# EAGLE design next_if_toy (EAGLE 9.6.2)
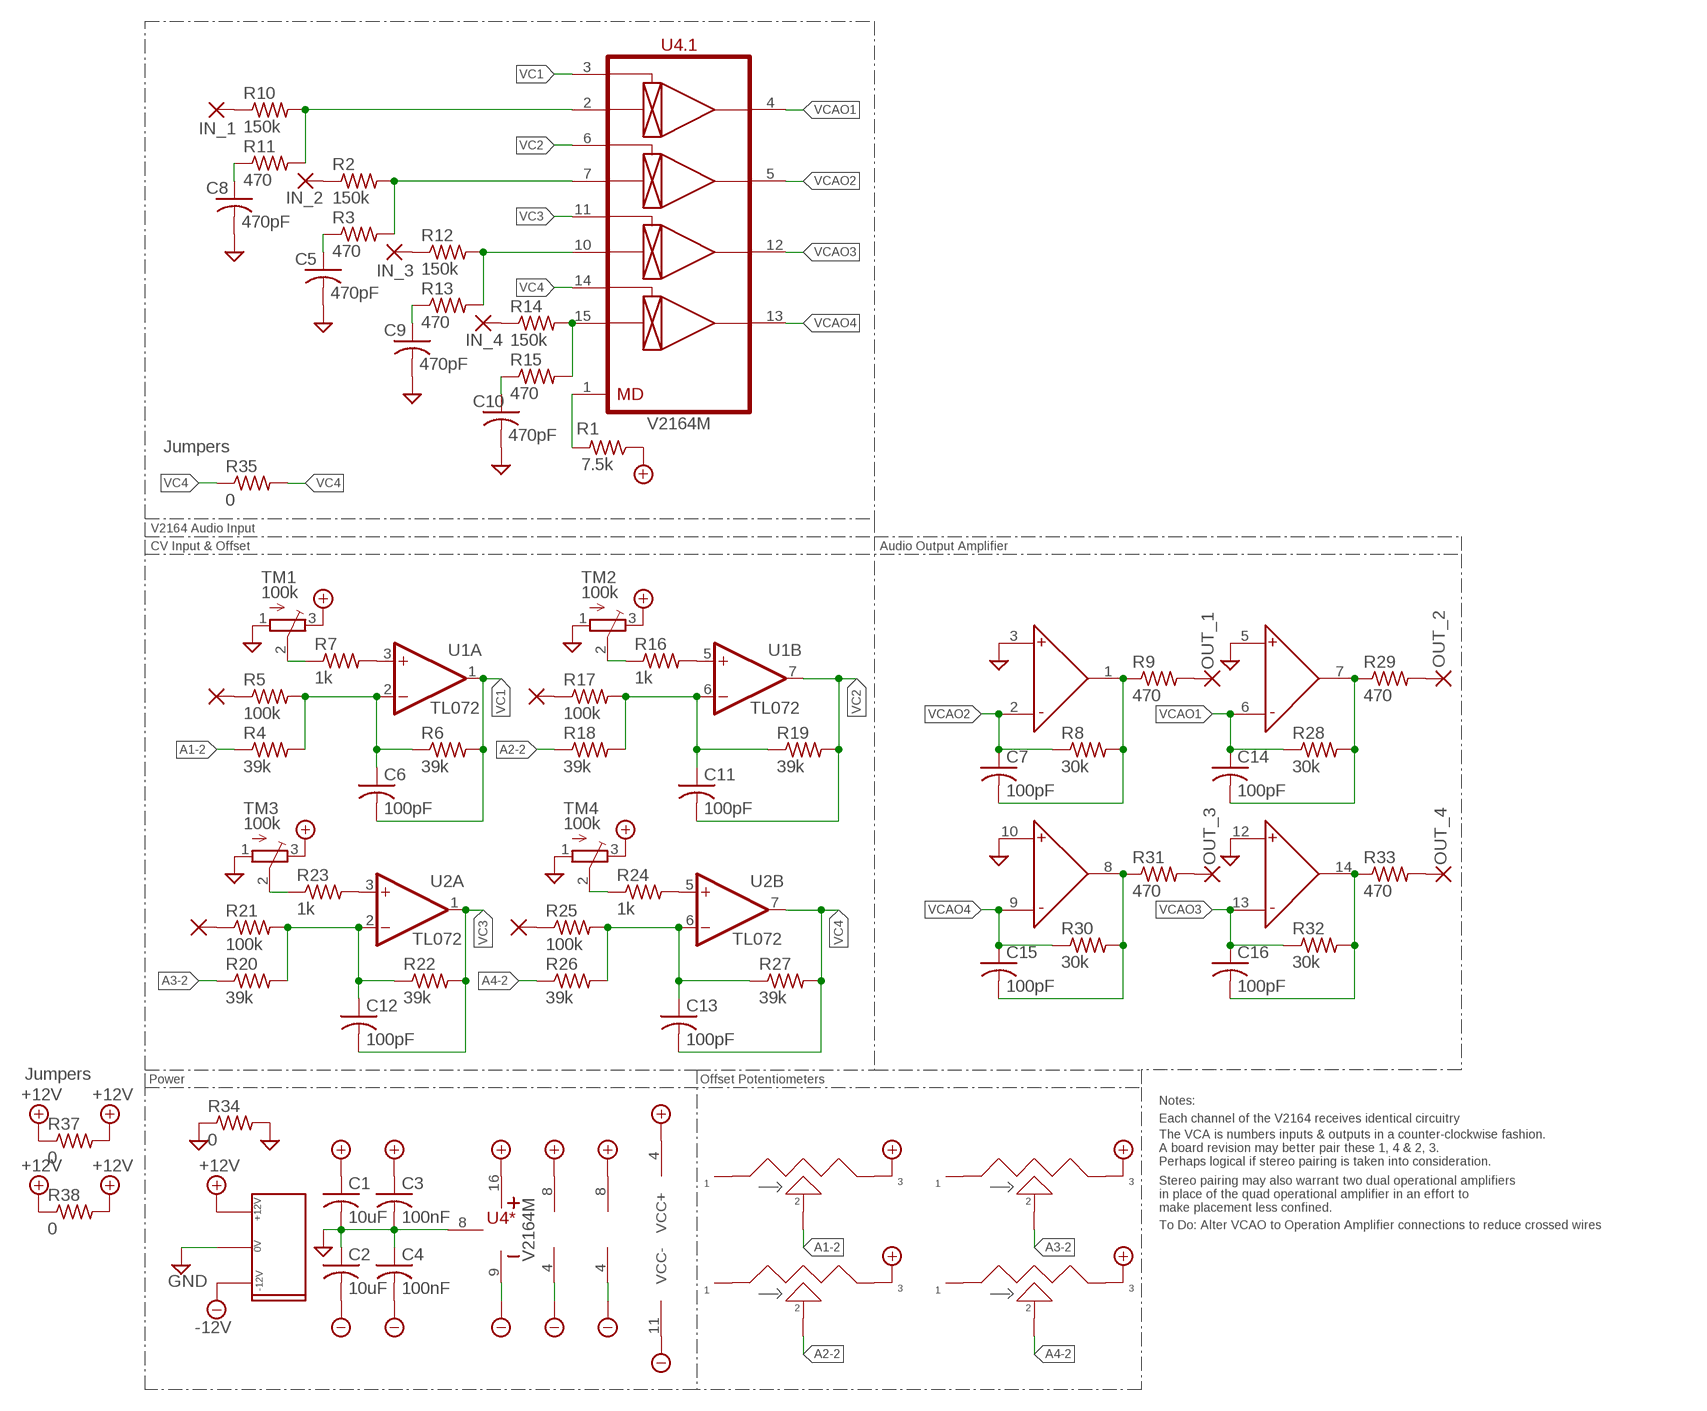
[diagram p0: schematic, sheet 1]

## Parts
AMT1  B50k  POT_9MM_SMD  [POT_9MM_SMD]
AMT2  B50k  POT_9MM_SMD  [POT_9MM_SMD]
AMT3  B50k  POT_9MM_SMD  [POT_9MM_SMD]
AMT4  B50k  POT_9MM_SMD  [POT_9MM_SMD]
C1  10uF  C-USC1206  [C1206]
C2  10uF  C-USC1206  [C1206]
C3  100nF  C-USC0603  [C0603]
C4  100nF  C-USC0603  [C0603]
C5  470pF  C-USC0603  [C0603]
C6  100pF  C-USC0603  [C0603]
C7  100pF  C-USC0603  [C0603]
C8  470pF  C-USC0603  [C0603]
C9  470pF  C-USC0603  [C0603]
C10  470pF  C-USC0603  [C0603]
C11  100pF  C-USC0603  [C0603]
C12  100pF  C-USC0603  [C0603]
C13  100pF  C-USC0603  [C0603]
C14  100pF  C-USC0603  [C0603]
C15  100pF  C-USC0603  [C0603]
C16  100pF  C-USC0603  [C0603]
CV1  SMD2  [SMD1,27-2,54]
CV2  SMD2  [SMD1,27-2,54]
CV3  SMD2  [SMD1,27-2,54]
CV4  SMD2  [SMD1,27-2,54]
I1  SMD2  [SMD1,27-2,54]
I2  SMD2  [SMD1,27-2,54]
I3  SMD2  [SMD1,27-2,54]
I4  SMD2  [SMD1,27-2,54]
O1  SMD2  [SMD1,27-2,54]
O2  SMD2  [SMD1,27-2,54]
O3  SMD2  [SMD1,27-2,54]
O4  SMD2  [SMD1,27-2,54]
R1  7.5k  R-US_R0603  [R0603]
R2  150k  R-US_R0603  [R0603]
R3  470  R-US_R0603  [R0603]
R4  39k  R-US_R0603  [R0603]
R5  100k  R-US_R0603  [R0603]
R6  39k  R-US_R0603  [R0603]
R7  1k  R-US_R0603  [R0603]
R8  30k  R-US_R0603  [R0603]
R9  470  R-US_R0603  [R0603]
R10  150k  R-US_R0603  [R0603]
R11  470  R-US_R0603  [R0603]
R12  150k  R-US_R0603  [R0603]
R13  470  R-US_R0603  [R0603]
R14  150k  R-US_R0603  [R0603]
R15  470  R-US_R0603  [R0603]
R16  1k  R-US_R0603  [R0603]
R17  100k  R-US_R0603  [R0603]
R18  39k  R-US_R0603  [R0603]
R19  39k  R-US_R0603  [R0603]
R20  39k  R-US_R0603  [R0603]
R21  100k  R-US_R0603  [R0603]
R22  39k  R-US_R0603  [R0603]
R23  1k  R-US_R0603  [R0603]
R24  1k  R-US_R0603  [R0603]
R25  100k  R-US_R0603  [R0603]
R26  39k  R-US_R0603  [R0603]
R27  39k  R-US_R0603  [R0603]
R28  30k  R-US_R0603  [R0603]
R29  470  R-US_R0603  [R0603]
R30  30k  R-US_R0603  [R0603]
R31  470  R-US_R0603  [R0603]
R32  30k  R-US_R0603  [R0603]
R33  470  R-US_R0603  [R0603]
R34  0  R-US_R0402  [R0402]
R35  0  R-US_R0402  [R0402]
R37  0  R-US_R0402  [R0402]
R38  0  R-US_R0402  [R0402]
TM1  100k  TRIMPOTTC33X  [TC33X]
TM2  100k  TRIMPOTTC33X  [TC33X]
TM3  100k  TRIMPOTTC33X  [TC33X]
TM4  100k  TRIMPOTTC33X  [TC33X]
U1  TL072  TL072TSSOP  [TSSOP-8]
U2  TL072  TL072TSSOP  [TSSOP-8]
U3  TL074TSSOP-14  [TL074TSSOP-14]
U4  V2164M  [SO-16]
U$2  EURO_POW_CEH  [EURO_POW_CEH]

## Nets
+12V: AMT1.3 AMT2.3 AMT3.3 AMT4.3 C1.1 C3.1 R1.1 R37.1 R37.2 R38.1 R38.2 TM1.3(E) TM2.3(E) TM3.3(E) TM4.3(E) U1.8(P:V+) U2.8(P:V+) U3.4(G$5-PWR:VCC+) U4.16(*:V+) U$2.+12V
-12V: C2.2 C4.2 U1.4(P:V-) U2.4(P:V-) U3.11(G$5-PWR:VCC-) U4.9(*:V-) U$2.-12V
A1-2: AMT1.2 R4.1
A2-2: AMT2.2 R18.1
A3-2: AMT3.2 R20.1
A4-2: AMT4.2 R26.1
GND: C1.2 C2.1 C3.2 C4.1 C5.2 C8.2 C9.2 C10.2 R34.1 R34.2 TM1.1(A) TM2.1(A) TM3.1(A) TM4.1(A) U3.3(G$1-A:I+) U3.5(G$2-B:I+) U3.10(G$3-C:I+) U3.12(G$4-D:I+) U4.8(*:GND) U$2.GND
I-1: C6.1 R4.2 R5.2 R6.1 U1.2(A:-IN)
I-2: C11.1 R17.2 R18.2 R19.1 U1.6(B:-IN)
I-3: C12.1 R20.2 R21.2 R22.1 U2.2(A:-IN)
I-4: C13.1 R25.2 R26.2 R27.1 U2.6(B:-IN)
MODE: R1.2 U4.1(.1:MD)
N$4: C5.1 R3.1
N$7: C8.1 R11.1
N$10: C9.1 R13.1
N$11: CV1.1(P) R5.1
N$14: C10.1 R15.1
N$17: R7.2 U1.3(A:+IN)
N$20: R16.2 U1.5(B:+IN)
N$23: CV2.1(P) R17.1
N$27: R23.2 U2.3(A:+IN)
N$36: R24.2 U2.5(B:+IN)
N$37: CV3.1(P) R21.1
N$38: CV4.1(P) R25.1
OUT_1: O1.1(P) R9.2
OUT_2: O2.1(P) R29.2
OUT_3: O3.1(P) R31.2
OUT_4: O4.1(P) R33.2
SJI_1: I1.1(P) R10.1
SJI_2: I2.1(P) R2.1
SJI_3: I3.1(P) R12.1
SJI_4: I4.1(P) R14.1
T1: R7.1 TM1.2(S)
T2: R16.1 TM2.2(S)
T3: R23.1 TM3.2(S)
T4: R24.1 TM4.2(S)
U3O1: C7.2 R8.2 R9.1 U3.1(G$1-A:O)
U3O2: C14.2 R28.2 R29.1 U3.7(G$2-B:O)
U3O3: C15.2 R30.2 R31.1 U3.8(G$3-C:O)
U3O4: C16.2 R32.2 R33.1 U3.14(G$4-D:O)
VC1: C6.2 R6.2 U1.1(A:OUT) U4.3(.1:CV1)
VC2: C11.2 R19.2 U1.7(B:OUT) U4.6(.1:CV2)
VC3: C12.2 R22.2 U2.1(A:OUT) U4.11(.1:CV3)
VC4: C13.2 R27.2 R35.1 R35.2 U2.7(B:OUT) U4.14(.1:CV4)
VCAI1: R10.2 R11.2 U4.2(.1:IN1)
VCAI2: R2.2 R3.2 U4.7(.1:IN2)
VCAI3: R12.2 R13.2 U4.10(.1:IN3)
VCAI4: R14.2 R15.2 U4.15(.1:IN4)
VCAO1: C14.1 R28.1 U3.6(G$2-B:I-) U4.4(.1:OUT1)
VCAO2: C7.1 R8.1 U3.2(G$1-A:I-) U4.5(.1:OUT2)
VCAO3: C16.1 R32.1 U3.13(G$4-D:I-) U4.12(.1:OUT3)
VCAO4: C15.1 R30.1 U3.9(G$3-C:I-) U4.13(.1:OUT4)
Unconnected: AMT1.1 AMT2.1 AMT3.1 AMT4.1

## Notes on the sheet
- IN_1
- IN_2
- IN_3
- IN_4
- Jumpers
- V2164 Audio Input
- CV Input & Offset | Audio Output Amplifier
- OUT_1 | OUT_2
- OUT_3 | OUT_4
- Jumpers | Power | Offset Potentiometers
- Notes:
- Each channel of the V2164 receives identical circuitry
- The VCA is numbers inputs & outputs in a counter-clockwise fashion.
  A board revision may better pair these 1, 4 & 2, 3.
  Perhaps logical if stereo pairing is taken into consideration.
- Stereo pairing may also warrant two dual operational amplifiers
  in place of the quad operational amplifier in an effort to
  make placement less confined.
- To Do: Alter VCAO to Operation Amplifier connections to reduce crossed wires

## Library data of the parts
AMT1-AMT4 = Potentiometers_SMD:POT_9MM_SMD
C1-C16 = adafruit:C-US: CAPACITOR, American symbol
CV1-CV4 I1-I4 O1-O4 = wirepad:SMD2: SMD PAD
R1-R35 R37 R38 = adafruit:R-US_: RESISTOR, American symbol
TM1-TM4 = adafruit:TRIMPOT: SMT trimmer potentiometer part number TC33X http://www.ladyada.net/library/eagle
U1 U2 = MusicThingModular:TL072: Generic Dual Op Amp
U3 = TL07x_TSSOP:TL074TSSOP-14: TL07xx Low-Noise FET-Input Operational Amplifier
U4 = ic-coolaudio:V2164
U$2 = 2.54mm_PowHeader_SMD:EURO_POW_CEH: Eurorack Power Header Reduced Card Edge Surface Mount Pads

## Board
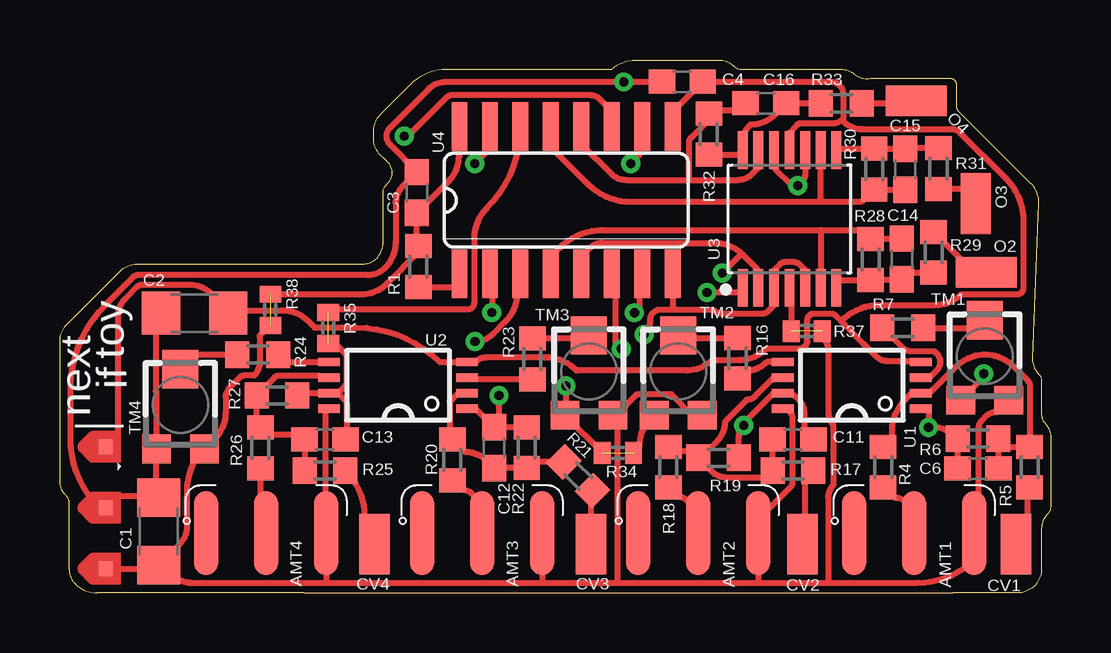
[diagram p1: board, top side]
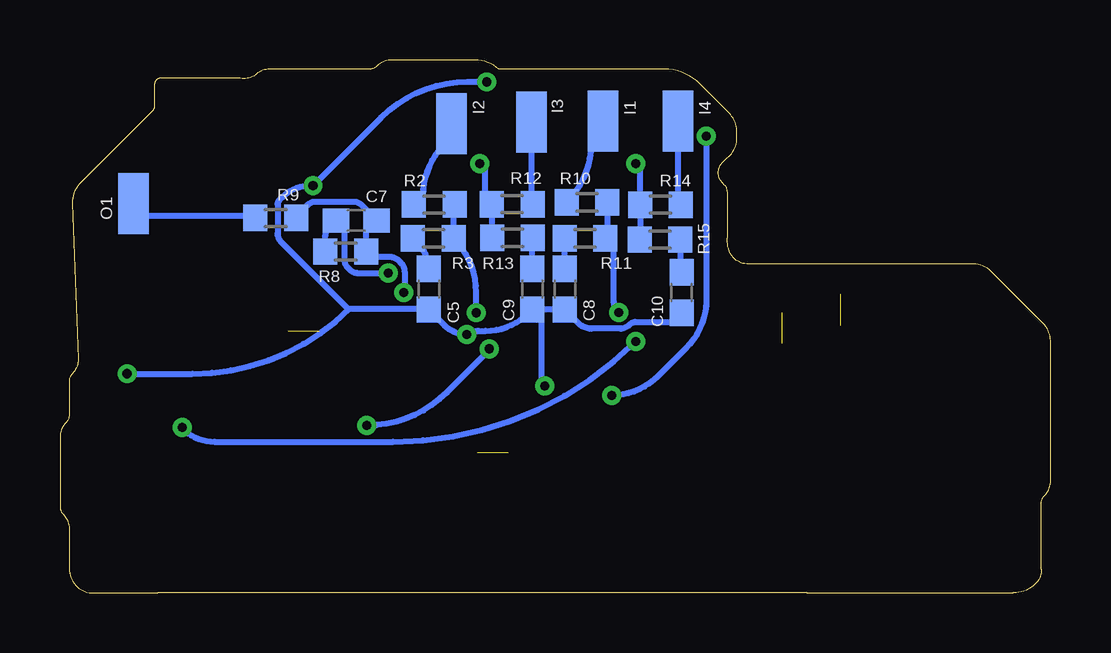
[diagram p2: board, bottom side, seen from below]

Size 41.28 x 22.23 mm. Coordinates in mm from the lower left corner, seen from the top.
Outline: 40.51,9.76 40.77,16.26 arc45 40.41,17.12 37.41,20.12 arc-45 37.34,20.3 37.34,21.21 arc90 37.09,21.46 33.76,21.46 arc-45 33.15,21.59 arc45 32.54,21.84 28.38,21.84 arc-45 28.07,21.97 arc45 27.46,22.23 24.11,22.23 arc45 22.99,21.84 16.29,21.84 arc45 14.73,21.34 13.46,20.07 arc45 13.08,19.38 13.08,18.8 arc45 13.48,18.15 13.66,17.96 arc-45 13.84,17.53 arc-45 13.66,17.09 13.59,17.02 arc45 13.46,16.71 13.46,14.86 arc-45 13.23,13.99 13.21,13.97 arc-45 12.6,13.72 3.43,13.72 arc45 2.56,13.48 0.26,11.18 arc45 0,10.44 0,4.68 arc45 0.26,4.06 arc-45 0.38,3.76 0.38,0.99 arc45 0.64,0.38 arc45 1.56,0 10.16,0 37.21,0 39.88,0 arc90 40.9,1.02 40.9,2.69 arc-45 41.15,3.3 arc45 41.28,3.61 41.28,6.5 arc45 41.02,7.11 arc-45 40.9,7.42 40.9,8.84 arc45 40.77,9.14 arc-45 40.51,9.76
Outline: 40.51,9.78 40.51,9.76
Copper layers (1*16): Top 0.035mm / dielectric 1.5mm / Bottom 0.035mm
Design rules "default *": minimum track width 6mil, minimum drill 0.35mm, track to track 6mil, track to pad 6mil, pad to pad 6mil, via to via 6mil, smd to smd 6mil, copper to edge 12mil, drill to drill 6mil, minimum pad ring 10mil, minimum via ring 8mil, stop-mask expansion 4mil, vias tented up to drill 0mil, thermal gap 10mil

### Footprints (pad centres in the part's own frame; a part is rotated, then mirrored left to right if it is on the bottom)
POT_9MM_SMD = smd 0.991 x 3.505: 1 -2.5,0; 2 0,0; 3 2.5,0
C1206 = smd 1.6 x 1.8: 1 -1.4,0; 2 1.4,0
C0603 = smd 1.1 x 1: 1 -0.85,0; 2 0.85,0
SMD1,27-2,54 = smd 1.27 x 2.54: 1 0,0
R0603 = smd 1 x 1.1: 1 -0.85,0; 2 0.85,0
R0402 = smd 0.7 x 0.9: 1 -0.65,0; 2 0.65,0
TC33X = smd 1.2 x 1.2: 1 -1,-1.825; 3 1,-1.825 | smd 1.5 x 1.6: 2 0,1.5
TSSOP-8 = smd 0.9 x 0.35: 1 -2.875,0.975; 2 -2.875,0.325; 3 -2.875,-0.325; 4 -2.875,-0.975; 5 2.875,-0.975; 6 2.875,-0.325; 7 2.875,0.325; 8 2.875,0.975
TL074TSSOP-14 = smd 1.572 x 0.407: 1 -2.872,1.95; 2 -2.872,1.3; 3 -2.872,0.65; 4 -2.872,0; 5 -2.872,-0.65; 6 -2.872,-1.3; 7 -2.872,-1.95; 8 2.872,-1.95; 9 2.872,-1.3; 10 2.872,-0.65; 11 2.872,0; 12 2.872,0.65; 13 2.872,1.3; 14 2.872,1.95
SO-16 = smd 0.66 x 2.032: 1 -4.445,-3.073; 2 -3.175,-3.073; 3 -1.905,-3.073; 4 -0.635,-3.073; 5 0.635,-3.073; 6 1.905,-3.073; 7 3.175,-3.073; 8 4.445,-3.073; 9 4.445,3.073; 10 3.175,3.073; 11 1.905,3.073; 12 0.635,3.073; 13 -0.635,3.073; 14 -1.905,3.073; 15 -3.175,3.073; 16 -4.445,3.073
EURO_POW_CEH = smd 0.6 x 0.6: +12V 0,-3.175; -12V 5.08,-3.175; GND 2.54,-3.175

### Placement (x,y rotation side)
AMT1  35.59,2.5 0 top
AMT2  26.59,2.5 0 top
AMT3  17.59,2.5 0 top
AMT4  8.59,2.5 0 top
C1  4.12,2.57 90 top
C2  5.61,11.67 0 top
C3  14.87,16.7 90 top
C4  25.93,21.31 0 top
C5  25.91,12.67 270 bottom
C6  38.25,5.2 180 top
C7  28.93,15.54 0 bottom
C8  20.25,12.67 270 bottom
C9  21.6,12.67 270 bottom
C10  15.38,12.53 270 bottom
C11  30.54,6.4 0 top
C12  18.1,6.06 90 top
C13  11.04,6.4 0 top
C14  35.08,13.93 270 top
C15  35.23,17.67 90 top
C16  29.41,20.42 0 top
CV1  39.84,2.04 0 top
CV2  30.93,2.04 0 top
CV3  22.12,2.04 0 top
CV4  13.11,2.04 0 top
I1  18.65,19.67 0 bottom
I2  24.96,19.57 0 bottom
I3  21.64,19.63 180 bottom
I4  15.53,19.67 0 bottom
O1  38.21,16.24 0 bottom
O2  38.59,13.37 90 top
O3  38.16,16.24 180 top
O4  35.67,20.52 90 top
R1  14.93,13.61 270 top
R2  25.69,16.2 0 bottom
R3  25.72,14.79 0 bottom
R4  34.3,5.25 90 top
R5  40.4,5.25 90 top
R6  38.25,6.44 180 top
R7  35.12,11.06 180 top
R8  29.37,14.24 0 bottom
R9  32.28,15.64 180 bottom
R10  19.32,16.29 0 bottom
R11  19.4,14.79 0 bottom
R12  22.44,16.21 180 bottom
R13  22.42,14.81 180 bottom
R14  16.26,16.19 180 bottom
R15  16.28,14.74 180 bottom
R16  28.23,9.79 270 top
R17  30.54,5.11 180 top
R18  25.35,5.25 90 top
R19  27.44,5.64 0 top
R20  16.35,5.55 90 top
R21  21.59,4.87 135 top
R22  19.45,6.06 90 top
R23  19.68,9.76 270 top
R24  8.25,9.94 0 top
R25  11.04,5.11 180 top
R26  8.35,6.05 90 top
R27  9.04,8.24 0 top
R28  33.78,13.91 270 top
R29  36.4,14.21 90 top
R30  33.93,17.68 90 top
R31  36.61,17.7 270 top
R32  27.04,19.13 270 top
R33  32.56,20.42 0 top
R34  23.24,5.84 0 top
R35  11.18,11.05 90 top
R37  31.12,10.92 180 top
R38  8.76,11.81 90 top
TM1  38.53,9.87 0 top
TM2  25.76,9.24 0 top
TM3  22.04,9.24 0 top
TM4  5.02,7.84 0 top
U1  32.99,8.66 180 top
U2  14.09,8.66 180 top
U3  30.4,15.6 90 top
U4  21.09,16.38 0 top
U$2  -1.27,1.02 90 top

### Tracks (layer width: path | path; a pad name or v marks a point on that pad's centre or on a via)
+12V  (2 unrouted)
  Top 0.254: C1.1 4.3,1.17 4.74,0.73 arc45 5.46,0.43 11.09,0.43 | 32.01,0.43 35.75,0.43 arc45 38.09,1.4 AMT1.3 38.09,3.8 38.27,3.98 38.27,6.84 arc-45 38.42,7.21 38.6,7.38 arc-45 38.96,7.53 39.02,7.53 TM1.3 | 11.09,0.43 20.09,0.43 | 20.09,0.43 23.22,0.43 | 23.22,0.43 29.09,0.43 | 29.09,0.43 32.01,0.43 | 29.09,0.43 AMT2.3 29.09,3.06 30.44,4.42 arc45 30.52,4.6 30.52,7.28 arc90 U1.8 | AMT3.3 20.09,0.43 | 11.09,0.43 AMT4.3 11.06,2.53 11.06,7.53 U2.8 | C1.1 5,2.05 arc45 5.3,2.77 5.3,4.28 arc-45 TM4.3 6.45,6.45 arc45 6.9,7.53 6.9,8.19 arc-45 7.05,8.55 7.5,8.99 arc-45 7.68,9.07 8.09,9.07 arc45 8.32,9.63 8.32,10.7 arc-45 8.34,10.76 8.74,11.16 R38.1 | TM3.3 23.19,7.26 | TM3.3 23.16,7.42 24.04,8.29 25.47,8.29 26.35,7.42 TM2.3 | U$2.+12V 3.96,1.02 C1.1 | 23.22,0.43 23.22,7.23 TM3.3 | R37.1 31.77,10.67 arc-45 32.02,10.05 32.02,7.49 arc45 32.22,7.02 32.22,4.49 arc45 32.01,3.98 32.01,0.43 | U3.4 30.47,12.66 R37.2 | U4.16 16.64,18.21 16.62,18.18 arc-45 16.2,17.18 C3.1 14.87,14.52 R1.1 14.93,14.21 13.63,12.91 arc-45 12.55,12.46 R38.2
-12V
  Top 0.254: U$2.-12V 2.41,6.6 2.41,11.55 arc-45 2.71,12.27 3.22,12.78 arc-45 3.4,12.85 5.38,12.85 arc-45 6.35,12.45 6.35,12.33 C2.2 7.57,11.67 7.69,11.79 9.26,11.79 arc-45 10.34,11.34 10.61,11.07 12.35,11.07 arc-45 15.81,9.63 U2.4 17.31,9.63 arc-45 17.75,9.82 20.22,9.82 arc-45 21.52,9.28 26.12,9.28 arc45 27.18,9.72 28.28,9.72 arc45 29.43,10.19 30.83,10.19 arc45 31.01,10.27 31.06,10.32 arc45 31.14,10.5 31.14,11.38 arc-45 31.21,11.56 31.23,11.58 arc-45 31.41,11.65 32.13,11.65 arc-45 32.31,11.58 32.55,11.34 | U1.4 35.82,9.68 34.41,9.68 arc-45 34.05,9.83 33.49,10.39 32.55,11.34 | U3.11 30.4,19.21 30.71,19.51 arc-45 30.89,19.59 32.22,19.59 arc45 32.61,19.75 32.63,19.75 | U4.9 25.53,20.07 C4.2 32.12,21.32 arc-90 32.63,20.81 32.63,19.75 | 32.55,11.34 arc-45 34.14,12 36.45,12 arc45 37.55,12.45 39.89,12.45 arc90 40.14,12.71 40.14,15.5 arc45 39.4,17.3 37.5,19.2 arc45 37.14,19.34 33.43,19.34 arc-45 32.63,19.68 32.63,19.75
A1-2
  Top 0.254: R4.1 34.64,4.06 arc45 34.85,3.97 arc-45 35.21,3.82 35.33,3.7 35.33,2.75 AMT1.2
A2-2
  Top 0.254: R18.1 25.73,4.02 arc-90 26.31,3.44 26.31,2.78 AMT2.2
A3-2
  Top 0.254: R20.1 16.73,4.32 arc-90 17.33,3.71 17.33,2.75 AMT3.2
A4-2
  Top 0.254: R26.1 8.35,3.74 8.59,3.5 AMT4.2
GND  (via drill 0.38)  (1 unrouted)
  Top 0.254: C1.2 4.04,4.04 | 4.04,4.04 4.02,4.07 TM4.1 4.02,8.39 3.99,8.42 3.99,11.45 C2.1 | 31.05,17.74 U3.10 31.05,17.41 arc-45 30.97,17.23 v30.74,16.99 30.6,16.99 arc-45 30.42,17.07 29.82,17.66 arc-45 29.75,17.84 U3.12 | U3.5 31.05,13.46 30.79,13.72 arc45 30.61,13.79 30.18,13.79 arc45 30,13.72 29.75,13.46 U3.3 29.75,11.99 29.49,11.74 arc-45 29.31,11.66 27.59,11.66 arc-45 27.21,11.82 25.53,11.82 | 4.04,4.04 2.39,4.04 U$2.GND 1.64,3.56 arc-45 0.44,6.46 0.44,8.46 arc-45 1.93,12.06 3.05,13.18 arc-45 3.23,13.26 12.83,13.26 arc45 13.54,13.55 arc45 13.98,14.63 13.98,16.24 arc-45 14.28,16.96 C3.2 14.87,17.57 13.75,18.69 arc-90 13.75,19.41 15.36,21.02 arc-45 16.08,21.31 v23.5,21.31 C4.1 | TM1.1 38.38,8.88 arc45 v38.48,9.14 | 25.53,11.82 25.02,11.82 arc90 24.59,11.39 arc-45 v24.34,10.78 | U4.8 25.53,11.82 | R34.1 22.59,5.86 TM3.1 21.08,7.46 v21.08,8.64 | R34.2 24.15,6.1 arc-45 24.65,7.3 TM2.1
  Bottom 0.254: C9.2 C8.2 19.68,11.25 arc-45 19.14,11.03 17.92,11.03 arc-45 17.56,11.18 17.55,11.19 arc45 17.28,11.3 15.76,11.3 C10.2 | C9.2 21.74,11.68 arc45 23.54,10.93 23.83,10.93 arc-45 24.21,10.78 v24.34,10.78 arc45 25.25,11.15 C5.2 26.11,11.63 26.34,11.86 29.21,11.86 | 29.21,11.86 29.28,11.86 32.06,14.64 arc45 32.21,15 32.21,16.2 arc45 32.14,16.38 32.01,16.51 arc45 30.88,16.97 30.86,16.99 v30.74,16.99 v30.73,16.99 27.89,19.82 arc45 24.3,21.31 v23.5,21.31 | v38.48,9.14 35.76,9.14 arc-45 29.21,11.86 | v21.08,8.64 21.21,8.76 21.21,8.89 21.22,8.9 21.22,11.44 C9.2
I-1
  Top 0.254: C6.1 R6.1 39.44,6.1 R5.2 40.41,6.11 40.41,8.65 arc45 40.34,8.83 39.7,9.47 arc45 38.55,9.94 arc45 37.33,9.44 36.65,8.76 36.65,8.75 36.23,8.34 U1.2 35.5,8.34 35.2,8.04 arc45 34.68,6.79 34.68,6.48 R4.2
I-2
  Top 0.254: R19.1 26.69,5.64 27.37,6.32 arc45 27.72,7.16 28.61,8.05 arc45 28.96,8.2 29.74,8.98 U1.6 | C11.1 R17.2 29.39,4.81 27.78,4.81 arc-45 27.16,5.06 R19.1 | R18.2 25.55,5.9 26.33,5.9 R19.1
I-3
  Top 0.254: R21.2 20.58,5.46 20.57,5.46 19.83,5.46 R22.1 C12.1 17.81,5.5 arc45 16.86,5.89 R20.2 16.23,6.51 16.23,7.98 16.6,8.34 16.77,8.34 U2.2
I-4
  Top 0.254: R25.2 C13.1 9.99,6.6 8.65,6.6 R26.2 8.19,7.06 R27.1 8.94,8.99 arc-45 9.12,9.07 10.7,9.07 arc-45 10.88,8.99 10.89,8.98 U2.6
MODE
  Top 0.254: R1.2 16.48,12.76 16.64,12.93 U4.1
N$4
  Bottom 0.254: C5.1 arc-45 26.35,14.57 R3.1
N$7
  Bottom 0.254: C8.1 R11.1
N$10
  Bottom 0.254: C9.1 21.6,14.78 R13.1
N$11
  Top 0.254: R5.1 40.3,4.3 40.3,2.5 CV1.1
N$14
  Bottom 0.254: R15.1 15.43,13.43 C10.1
N$17
  Top 0.254: R7.2 35.09,10.24 arc45 35.45,10.09 36.32,10.09 arc-45 36.5,10.02 36.52,9.99 arc-90 36.52,9.28 36.23,8.98 U1.3
N$20
  Top 0.254: U1.5 29.48,9.63 arc45 29.42,9.61 arc-45 28.53,9.24 R16.2
N$23
  Top 0.254: CV2.1 31.03,2.14 31.03,4.75 R17.1
N$27
  Top 0.254: U2.3 17.04,8.91 R23.2
N$36
  Top 0.254: R24.2 9.4,9.63 U2.5
N$37
  Top 0.254: R21.1 22.12,4.29 CV3.1
N$38
  Top 0.254: R25.1 arc-45 12.69,3.18 12.69,2.46 CV4.1
OUT_1
  Bottom 0.254: O1.1 37.7,15.73 33.23,15.73 R9.2
OUT_2
  Top 0.254: R29.2 38.09,13.37 O2.1
OUT_3
  Top 0.254: O3.1 38.27,16.85 R31.2
OUT_4
  Top 0.254: R33.2 35.55,20.42 O4.1
SJI_1
  Bottom 0.254: R10.1 arc-45 19.16,18.73 19.16,19.16 I1.1
SJI_2
  Bottom 0.254: I2.1 24.96,18.98 25.31,18.64 arc-45 26.16,16.58 R2.1
SJI_3
  Bottom 0.254: I3.1 21.64,16.26 R12.1
SJI_4
  Bottom 0.254: I4.1 15.53,16.31 R14.1
T1
  Top 0.254: R7.1 38.23,11.06 TM1.2
T2
  Top 0.254: TM2.2 25.86,10.64 R16.1
T3
  Top 0.254: R23.1 21.91,10.61 TM3.2
T4
  Top 0.254: TM4.2 5.62,9.94 R24.1
U3O1  (via drill 0.38)
  Top 0.254: U3.1 28.45,12.6 28.38,12.53 v26.96,12.53
  Bottom 0.254: 28.52,15.1 R8.2 28.29,14.02 27.53,14.02 arc45 27.17,13.87 27.07,13.77 arc45 26.92,13.41 26.92,12.57 v26.96,12.53 | 28.52,15.1 28.52,15.99 28.7,16.17 arc-45 29.06,16.32 30.61,16.32 arc-45 30.97,16.17 31.43,15.71 R9.1 | 28.52,15.1 C7.2
U3O2
  Top 0.254: U3.7 32.35,13.06 R28.2 33.8,13.08 C14.2 35.36,13.36 R29.1
U3O3
  Top 0.254: U3.8 32.35,18.53 R30.2 33.94,18.52 C15.2 35.26,18.55 R31.1
U3O4
  Top 0.254: R33.1 C16.2 29.81,19.96 arc-45 28.78,19.54 28.71,19.47 arc45 28.49,18.93 28.49,18.51 U3.14 28.26,18.28 R32.2
VC1  (via drill 0.38)
  Top 0.254: C6.2 R6.2 37.35,6.49 arc45 36.24,6.95 v36.19,6.9 36.19,7.68 U1.1 | v17.29,10.49 arc45 18.04,10.8 18.54,11.29 arc45 19.06,12.55 19.06,13.18 U4.3
  Bottom 0.254: v36.19,6.9 36.19,6.87 arc-45 34.84,6.31 27.39,6.31 arc-45 v17.29,10.49
VC2  (via drill 0.38)
  Top 0.254: C11.2 31.02,6.76 31.02,7.48 arc90 30.16,8.34 U1.7 29.74,8.34 28.49,7.08 v28.49,6.98 arc45 28.29,6.49 R19.2 | U4.6 22.99,12.53 23.13,12.39 23.13,10.54 arc45 23.21,10.36 v23.39,10.18
  Bottom 0.254: v23.39,10.18 23.39,10.13 25.16,8.36 arc45 v28.49,6.98
VC3  (via drill 0.38)
  Top 0.254: U2.1 17.32,7.68 C12.2 18.29,6.91 | R22.2 18.29,6.91 | v14.35,19.05 14.5,19.05 16.14,20.69 arc-45 16.28,20.75 22.12,20.75 arc-45 22.48,20.6 22.99,20.09 U4.11 | v18.29,8.24 18.29,6.91
  Bottom 0.254: v14.35,19.05 14.35,12.23 arc45 15.18,10.22 16.36,9.04 arc45 v18.29,8.24
VC4  (1 unrouted)
  Top 0.254: R27.2 9.98,8.34 U2.7 11.58,8.34 | 11.58,8.34 11.87,8.05 arc-45 11.94,7.87 11.94,6.45 C13.2 | 11.58,8.34 11.87,8.62 arc45 11.94,8.8 11.94,9.82 arc45 11.87,10 11.47,10.4 R35.1 | U4.14 arc-45 17.76,16.03 arc45 17.25,14.79 17.25,12.08 arc-90 17,11.83 11.3,11.83 R35.2
VCAI1  (via drill 0.38)
  Top 0.254: v17.99,11.7 18.01,11.72 18.01,13.21 U4.2
  Bottom 0.254: v17.99,11.7 v18,11.71 arc45 18.22,12.25 18.22,14.46 R11.2 18.57,14.81 18.47,14.91 R10.2
VCAI2  (via drill 0.38)
  Top 0.254: U4.7 24.14,13.18 24.14,11.89 v23.93,11.69
  Bottom 0.254: R2.2 24.87,16.17 R3.2 arc45 23.93,12.54 v23.93,11.69
VCAI3  (via drill 0.38)
  Top 0.254: U4.10 24.26,18.73 arc-45 24.01,18.12 v23.79,17.9
  Bottom 0.254: v23.79,17.9 23.59,17.7 23.59,16.51 R12.2 23.27,16.19 R13.2
VCAI4  (via drill 0.38)
  Top 0.254: v17.29,17.9 17.79,18.4 17.79,19.33 U4.15
  Bottom 0.254: R15.2 17.11,14.76 R14.2 17.11,17.72 v17.29,17.9
VCAO1
  Top 0.152: 33.4,15.13 33.48,15.06
  Top 0.254: 31.7,15.13 U3.6 | U4.4 20.48,13.33 20.48,14.06 20.81,14.39 arc-45 22.61,15.13 31.7,15.13 | 33.48,15.06 R28.1 33.8,14.78 C14.1 | 31.7,15.13 33.4,15.13
VCAO2  (via drill 0.38)
  Top 0.254: 28.46,14.1 29.02,13.54 arc-45 29.1,13.36 U3.2 | 28.46,14.1 arc45 27.26,14.6 22.61,14.6 arc45 22.07,14.38 21.88,14.18 21.88,13.46 U4.5 | v27.59,13.34 28.36,14.1 28.46,14.1
  Bottom 0.254: R8.1 30.22,14.89 arc45 30.07,15.25 C7.1 29.42,15.19 29.42,13.91 arc-45 29.28,13.55 29.21,13.49 arc-45 28.85,13.34 v27.59,13.34
VCAO3
  Top 0.254: U4.12 21.75,19.43 21.75,18.7 22.97,17.48 arc45 23.58,17.23 26.16,17.23 | C16.1 28.43,20.42 28.12,20.11 27.16,20.11 R32.1 27.04,19.73 26.28,18.97 arc45 26.21,18.79 26.21,17.27 26.16,17.23 | U3.13 29.1,17.74 28.84,17.48 arc-45 28.23,17.23 26.16,17.23
VCAO4
  Top 0.254: U4.13 20.45,18.6 22,17.06 arc45 23.79,16.31 31.7,16.31 | 31.7,16.31 U3.9 | 31.7,16.31 33.31,16.31 arc45 33.49,16.39 R30.1 C15.1

### Text on the board
tPlace: toy | if | __ | next